# EAGLE design PT4115-Driver (EAGLE 7.1.0)
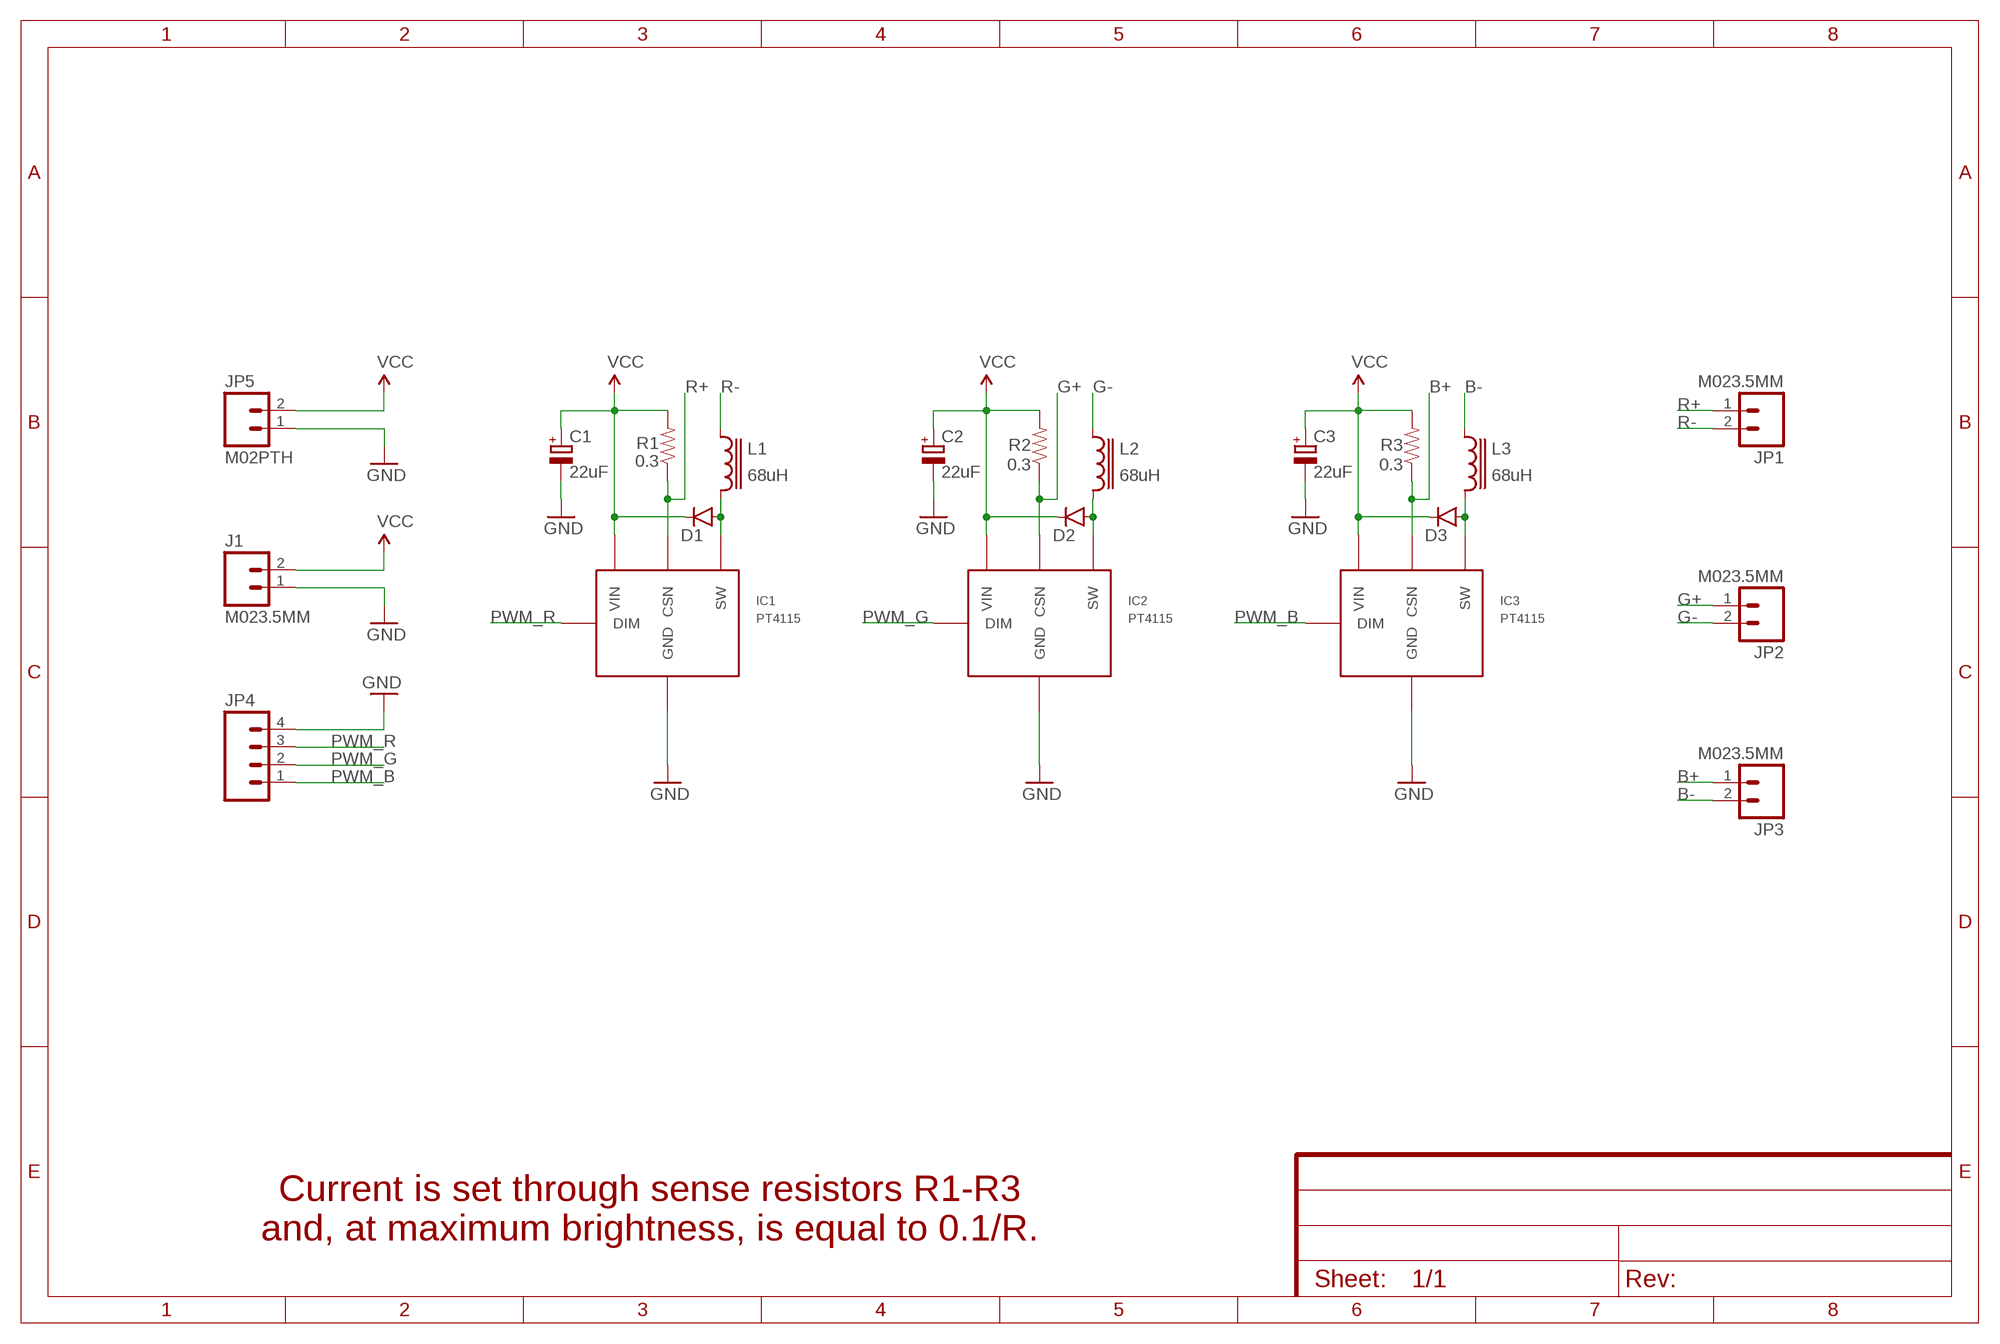
[diagram p0: schematic, sheet 1]
FRAME1 (FRAME-A4L): CNAME: PT4115 3-channel (RGB) LED Driver; CREVISION: 1; DESIGNER: Francesco Truzzi; LICENSE: Released under CC BY-NC-SA 4.0

## Parts
C1  22uF  CPOL-EUD/7343-31R  [D/7343-31R]
C2  22uF  CPOL-EUD/7343-31R  [D/7343-31R]
C3  22uF  CPOL-EUD/7343-31R  [D/7343-31R]
D1  DIODESMA-KIT  [SMA-DIODE-KIT]
D2  DIODESMA-KIT  [SMA-DIODE-KIT]
D3  DIODESMA-KIT  [SMA-DIODE-KIT]
IC1  PT4115  [PT4115]
IC2  PT4115  [PT4115]
IC3  PT4115  [PT4115]
J1  M023.5MM  [SCREWTERMINAL-3.5MM-2]
JP1  M023.5MM  [SCREWTERMINAL-3.5MM-2]
JP2  M023.5MM  [SCREWTERMINAL-3.5MM-2]
JP3  M023.5MM  [SCREWTERMINAL-3.5MM-2]
JP4  M04LONGPADS  [1X04_LONGPADS]
JP5  M02PTH  [1X02]
L1  68uH  ELL6  [ELL6]
L2  68uH  ELL6  [ELL6]
L3  68uH  ELL6  [ELL6]
R1  0.3  0.3OHM-1/8W-1%(0805)  [0805]
R2  0.3  0.3OHM-1/8W-1%(0805)  [0805]
R3  0.3  0.3OHM-1/8W-1%(0805)  [0805]

## Nets
B+: IC3.4(CSN) JP3.1 R3.1
B-: JP3.2 L3.1
G+: IC2.4(CSN) JP2.1 R2.1
G-: JP2.2 L2.1
GND: C1.- C2.- C3.- IC1.2(GND) IC1.2A(GND) IC2.2(GND) IC2.2A(GND) IC3.2(GND) IC3.2A(GND) J1.1 JP4.4 JP5.1
N$2: D1.A IC1.1(SW) L1.2
N$4: D2.A IC2.1(SW) L2.2
N$7: D3.A IC3.1(SW) L3.2
PWM_B: IC3.3(DIM) JP4.1
PWM_G: IC2.3(DIM) JP4.2
PWM_R: IC1.3(DIM) JP4.3
R+: IC1.4(CSN) JP1.1 R1.1
R-: JP1.2 L1.1
VCC: C1.+ C2.+ C3.+ D1.C D2.C D3.C IC1.5(VIN) IC2.5(VIN) IC3.5(VIN) J1.2 JP5.2 R1.2 R2.2 R3.2

## Notes on the sheet
- Current is set through sense resistors R1-R3
  and, at maximum brightness, is equal to 0.1/R.

## Library data of the parts
C1-C3 = rcl:CPOL-EU: POLARIZED CAPACITOR, European symbol
D1-D3 = SparkFun-DiscreteSemi:DIODE: Diode These are standard reverse protection diodes and small signal diodes. SMA package can handle up to about 1A. SOD-323 can handle about 200mA. What the SOD-323 package when ordering, there are some mfgs out there that are 5-pin packages.
IC1-IC3 = PT4115:PT4115: 30V, 1.2A Step-down High Brightness LED Driver with 5000:1 Dimming PDF: http://www.google.pl/url?sa=t&rct=j&q=PT4115&source=web&cd=1&ved=0CC4QFjAA&url=http%3A%2F%2Fwww.micro-bridge.com%2Fdata%2FCRpowtech%2FPT4115E.pdf&ei=9NbxUKXPJNSzhAem2oGoAQ&usg=AFQjCNEsPWIIWjIVjxpF5YN6SPR3coTTpw&bvm=bv.1357700187,d.d2k
J1 JP1-JP3 JP5 = SparkFun-Connectors:M02: Standard 2-pin 0.1" header. Use with - straight break away headers ( PRT-00116) - right angle break away headers (PRT-00553) - swiss pins (PRT-00743) - machine pins (PRT-00117) - female headers (PRT-00115) Molex polarized connector foot print use with: PRT-08233 with associated crimp pins and housings. 2.54_SCREWTERM for use with PRT-10571. 3.5mm Screw Terminal footprints for PRT-08084 5mm Screw Terminal footprints for use with PRT-08432
JP4 = SparkFun-Connectors:M04: Header 4 Standard 4-pin 0.1" header. Use with straight break away headers (SKU : PRT-00116), right angle break away headers (PRT-00553), swiss pins (PRT-00743), machine pins (PRT-00117), and female headers (PRT-00115). Molex polarized connector foot print use with SKU : PRT-08231 with associated crimp pins and housings. 1MM SMD Version SKU: PRT-10208
L1-L3 = inductor-panasonic:ELL6: Series H Inductor ELL6RH, ELL6SH, ELL6UH
R1-R3 = SparkFun-Resistors:0.3OHM-1/8W-1%(0805): RES-11622; PROD_ID: RES-11622

## Board
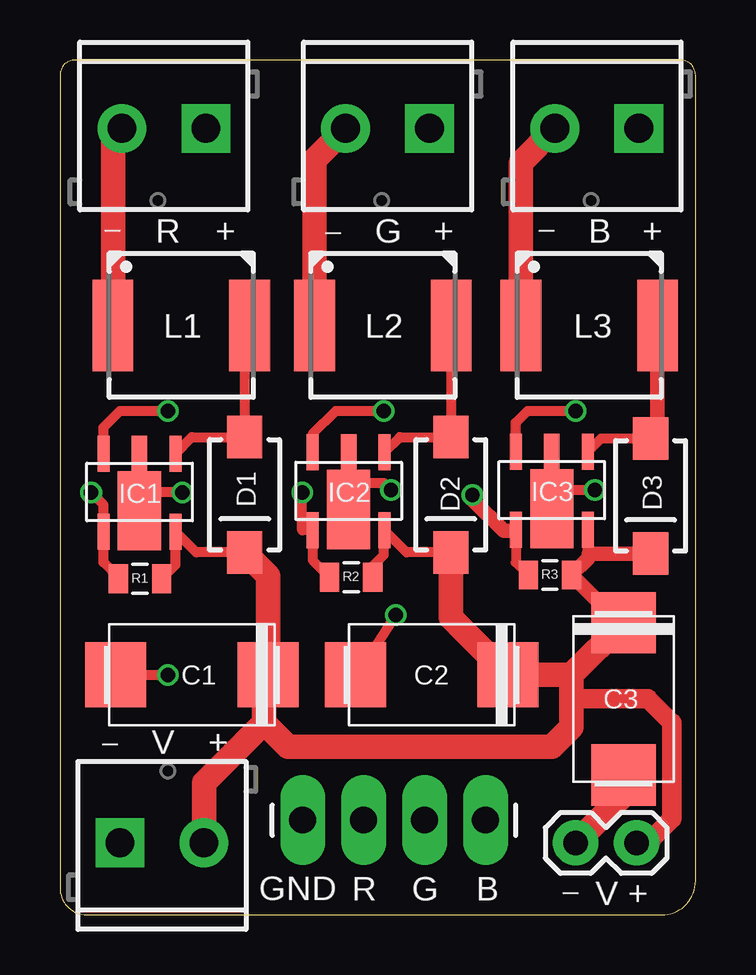
[diagram p1: board, top side]
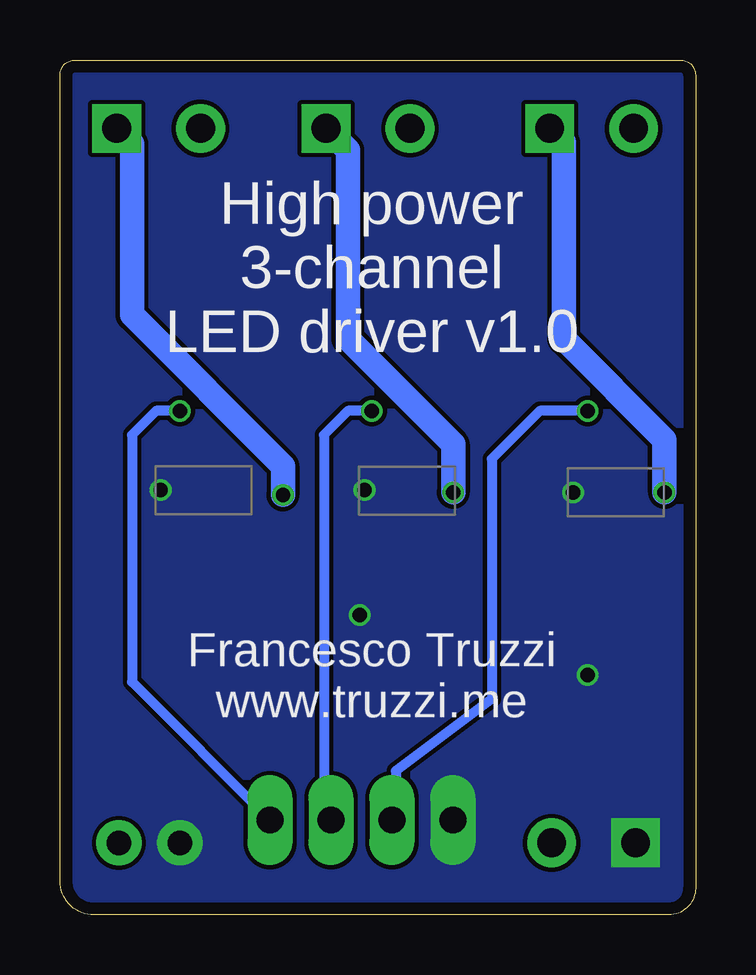
[diagram p2: board, bottom side, seen from below]

Size 26.5 x 35.62 mm. Coordinates in mm from the lower left corner, seen from the top.
Outline: 0,34.99 0,1.12 arc90 1.12,0 25.09,0 arc90 26.5,1.41 26.5,35 arc90 25.88,35.62 0.63,35.62 arc90 0,34.99
Copper layers (1*16): Top 0.035mm / dielectric 1.5mm / Bottom 0.035mm
Design rules "ShenZhen2U EagleRules": minimum track width 7mil, minimum drill 12mil, track to track 7mil, track to pad 7mil, pad to pad 7mil, via to via 7mil, smd to smd 0mil, copper to edge 20mil, drill to drill 10mil, minimum pad ring 10mil, minimum via ring 6mil, stop-mask expansion 2mil, vias tented up to drill 25mil, thermal gap 10mil

### Footprints (pad centres in the part's own frame; a part is rotated, then mirrored left to right if it is on the bottom)
D/7343-31R = smd 2.55 x 2.7: + 3.175,0; - -3.175,0
SMA-DIODE-KIT = smd 1.77 x 1.47: A -2.4,0; C 2.4,0
PT4115 = smd 0.5 x 1.5: 1 0,0; 3 3,0; 4 3,3.25; 5 0,3.25 | smd 0.65 x 1.5: 2 1.5,0 | smd 1.8 x 3.3: 2A 1.5,2.375
SCREWTERMINAL-3.5MM-2 = drill 1.2 pad 2.032 square: 1 0,0 | drill 1.2 pad 2.032: 2 3.5,0
1X04_LONGPADS = drill 1.118 pad 1.88 long: 1 0,0; 2 2.54,0; 3 5.08,0; 4 7.62,0
1X02 = drill 1.016 pad 1.88: 1 0,0; 2 2.54,0
ELL6 = smd 1.7 x 3.8: 1 -2.85,0; 2 2.85,0
0805 = smd 0.8 x 1.2: 1 -0.9,0; 2 0.9,0

### Placement (x,y rotation side)
C1  5.5,10 0 top
C2  15.5,10 0 top
C3  23.5,9 90 top
D1  7.7,17.5 270 top
D2  16.3,17.5 270 top
D3  24.62,17.46 270 top
IC1  4.82,19.22 180 top
IC2  13.54,19.27 180 top
IC3  22.01,19.3 180 top
J1  2.5,3 0 top
JP1  6.08,32.77 180 top
JP2  15.41,32.77 180 top
JP3  24.14,32.77 180 top
JP4  17.74,3.95 180 top
JP5  21.5,3 0 top
L1  5.06,24.56 0 top
L2  13.46,24.56 0 top
L3  22.06,24.56 0 top
R1  3.34,14 0 top
R2  12.14,14.07 0 top
R3  20.43,14.16 0 top

### Tracks (layer width: path | path; a pad name or v marks a point on that pad's centre or on a via)
B+  (via drill 0.6)
  Top 0.406: R3.1 19.01,14.68 IC3.4 18.96,16
  Top 0.61: v17.2,17.5 17.2,17.3 18.5,16 18.96,16
  Bottom 1.016: JP3.1 23.5,32.13 23.5,25 17.2,18.7 v17.2,17.5
B-
  Top 1.016: L3.1 19.21,31.34 JP3.2
G+  (via drill 0.6)
  Top 0.406: v10.1,17.6 10.1,16.02 IC2.4 10.54,14.78 R2.1
  Bottom 1.016: JP2.1 14.5,31.86 14.5,24 10.1,19.6 v10.1,17.6
G-
  Top 1.016: L2.1 10.61,31.47 JP2.2
GND  (via drill 0.6)
  Top 0.406: C3.- 23.5,5 | v5.1,17.6 4.07,17.6 3.98,17.51 | 3.98,17.51 IC1.2A | IC1.2 3.32,18.18 3.98,17.51 | IC2.2 12.04,18.46 12.5,18 | 12.5,18 13.5,18 v13.8,17.7 | IC2.2A 12.04,17.54 12.5,18 | v22.3,17.7 20.8,17.7 | 20.8,17.7 20.5,18 IC3.2 | 20.8,17.7 20.8,17.22 IC3.2A | C2.- 12.32,9.88 v14,12.5 | C1.- v4.5,10
  Top 1.016: 23.5,5 JP5.1
  pour Bottom (no thermals): 25.09,0 1.17,0 arc-90 0,1.17 0.01,34.81 arc-91 0.79,35.6 25.9,35.6 arc-90 26.5,35 26.5,1.41 arc-90
N$2
  Top 0.406: L1.2 7.7,24.35 D1.A 5.5,19.9 IC1.1
N$4
  Top 0.406: L2.2 16.3,24.55 D2.A 14.17,19.9 IC2.1
N$7
  Top 0.406: IC3.1 22.56,19.86 D3.A 24.91,20.14
  Top 0.61: 24.91,20.14 L3.2
PWM_B  (via drill 0.6)
  Top 0.406: IC3.3 19.01,20.51 19.5,21 v21.5,21
  Bottom 0.406: v21.5,21 22.5,21 23.5,20 23.5,9.71 JP4.1
PWM_G  (via drill 0.6)
  Top 0.406: IC2.3 10.54,20.04 11.5,21 v13.5,21
  Bottom 0.406: v13.5,21 14.5,21 15.5,20 15.5,4.25 JP4.2
PWM_R  (via drill 0.6)
  Top 0.406: IC1.3 1.82,20.32 2.5,21 v4.5,21
  Bottom 0.406: v4.5,21 6.5,21 8.5,19 8.5,9 12.5,6 12.5,4.11 JP4.3
R+  (via drill 0.6)
  Top 0.254: R1.1 2.44,14.06
  Top 0.406: 2.44,14.06 1.82,14.68 IC1.4 1.82,17.08 v1.3,17.6
  Bottom 1.016: v1.3,17.6 1.3,19.8 5.5,24 5.5,32.19 JP1.1
R-
  Top 1.016: L1.1 2.21,32.4 JP1.2
VCC
  Top 0.406: R1.2 4.82,14.58 IC1.5 5.68,15.1 D1.C | D2.C 14.45,15.1 IC2.5 13.5,15.98 13.5,15 13.04,14.54 R2.2 | 22.01,14.84 22.01,15 | 22.01,15 IC3.5 | 22.06,15.06 22.01,15 | C3.+ 23.31,12.18
  Top 0.61: 22.01,14.84 R3.2 23.31,12.18 | D3.C 22.06,15.06
  Top 0.813: 24.5,3 25.5,4 25.5,8 24.5,9 21.32,9
  Top 1.016: 21.32,10 C2.+ 16.3,12.38 D2.C | 21.32,10 C3.+ | D1.C 8.68,14.12 C1.+ 8.5,9.82 8.5,8 | 21.32,10 21.32,9 21.32,7.83 20.5,7 9.5,7 8.5,8 | JP5.2 24.5,3 | J1.2 6,5.5 8.5,8

### Text on the board
tPlace: _ | R | + | _ | G | + | _ | B | + | _ | V | + | R | G | B | GND | _ | V | +
bPlace: High power / 3-channel / LED driver v1.0 | Francesco Truzzi / www.truzzi.me